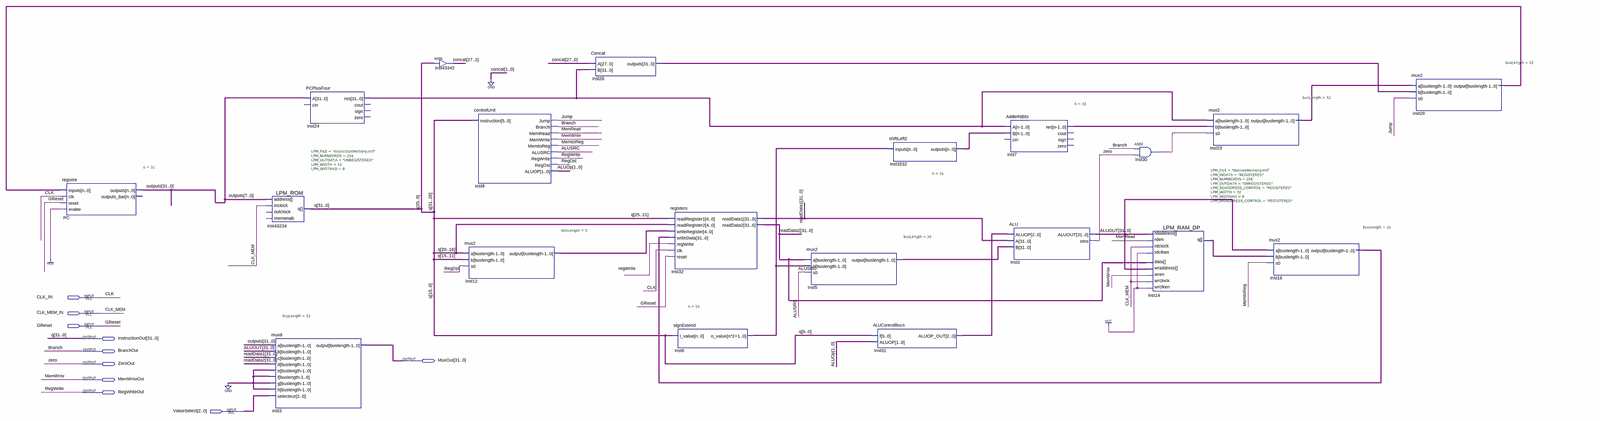
[diagram p0: schematic sheet, whole]
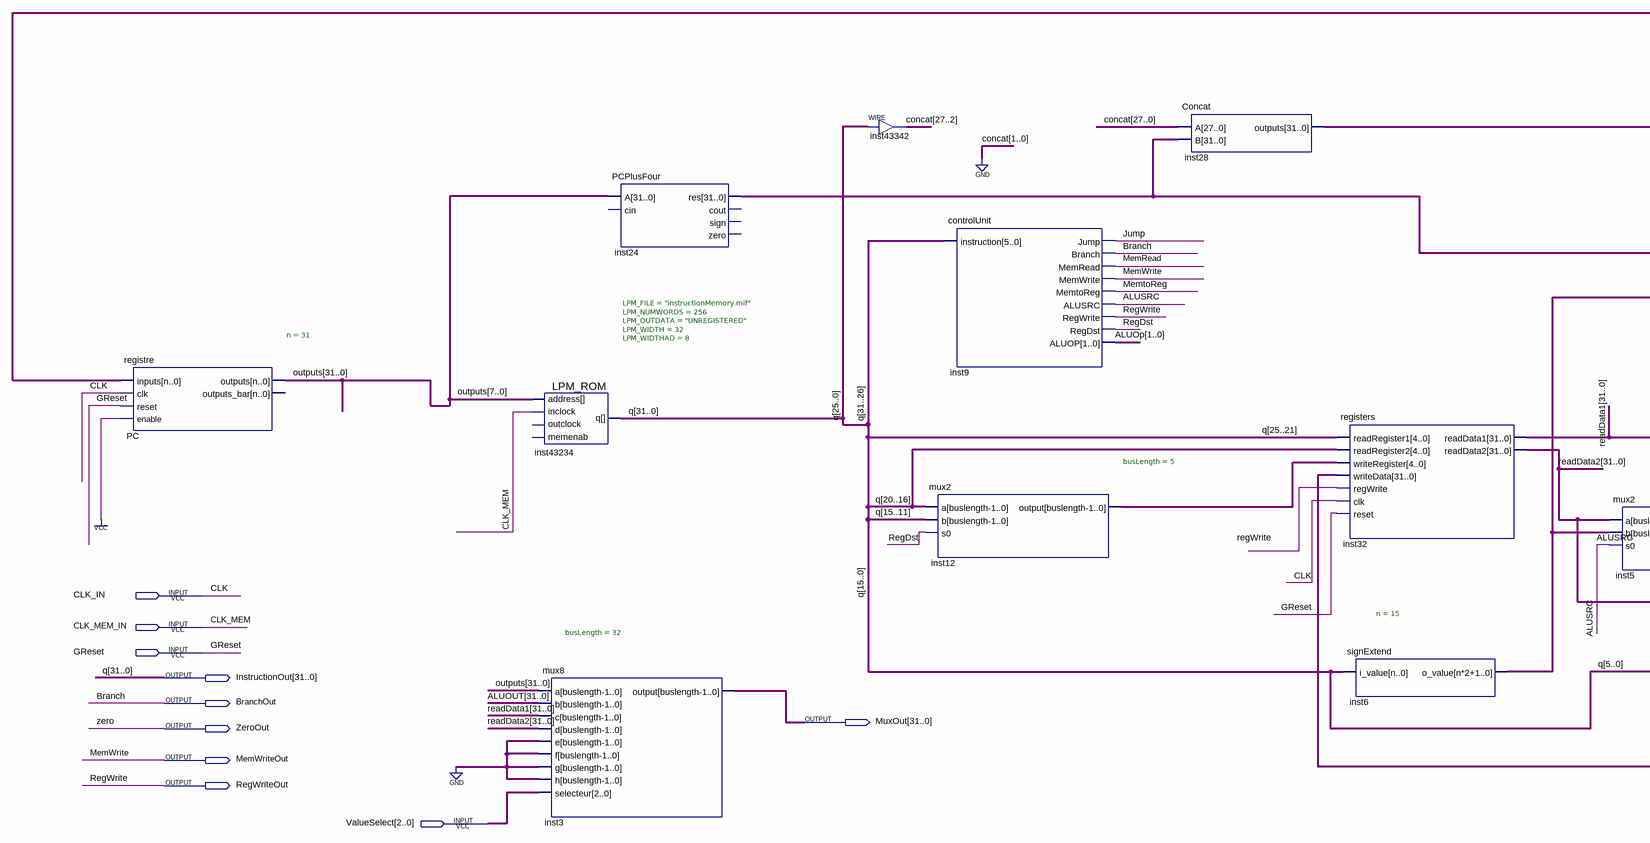
[diagram p1: schematic sheet, left part]
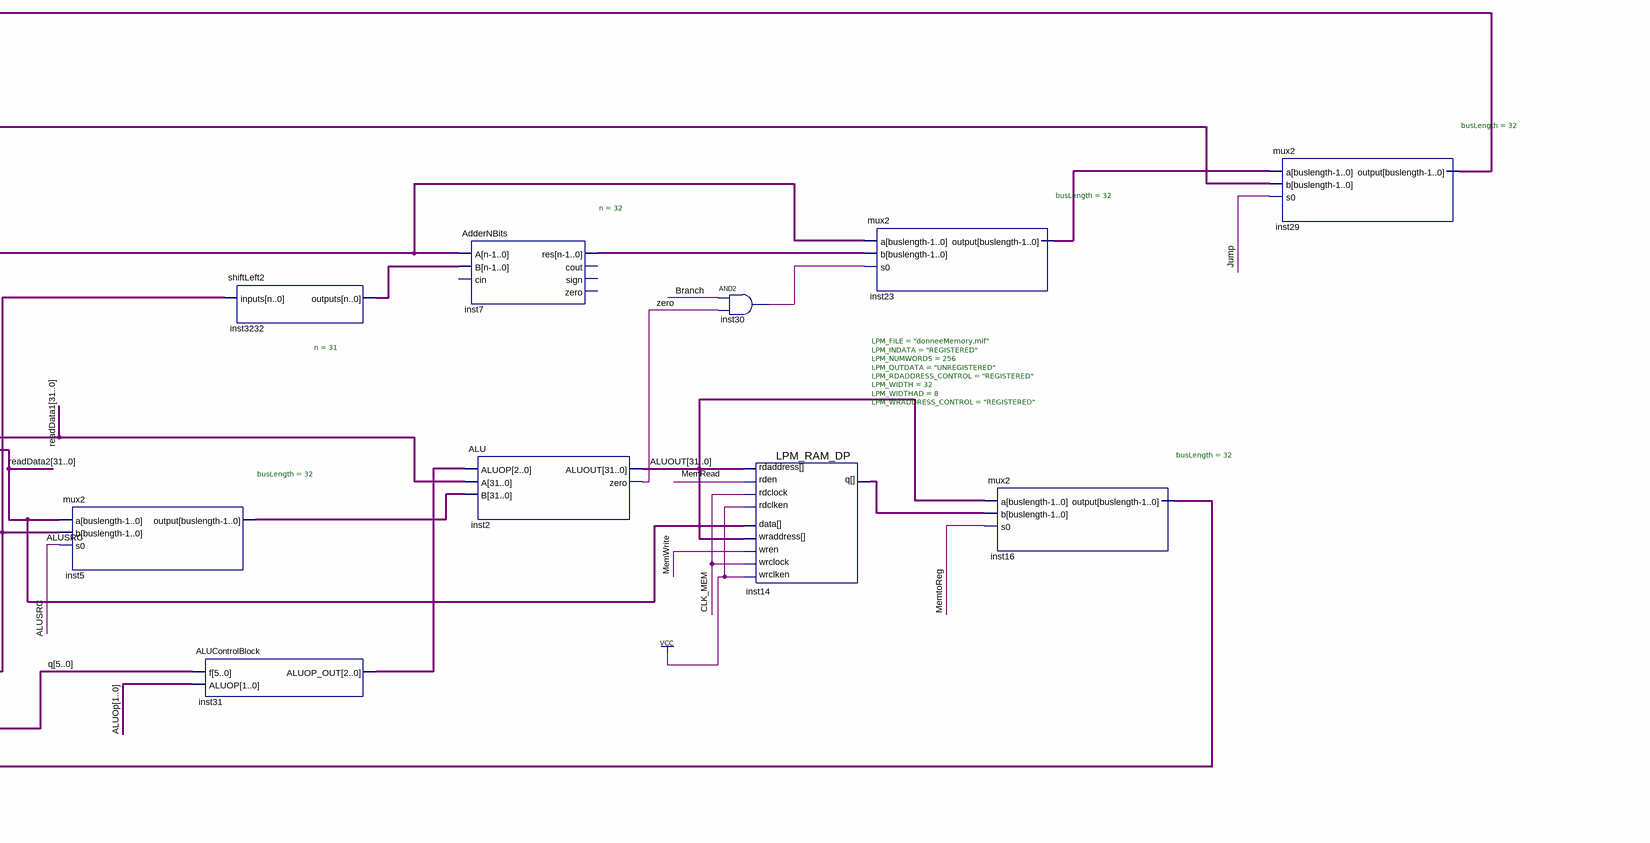
[diagram p2: schematic sheet, right part]
// Quartus schematic Lab2.bdf as structural Verilog: 20 symbols, 10 pins
module Lab2 (
  input  CLK_IN,
  input  CLK_MEM_IN,
  input  GReset,
  input  [2:0] ValueSelect,
  output [31:0] InstructionOut,
  output BranchOut,
  output [31:0] MuxOut,
  output ZeroOut,
  output MemWriteOut,
  output RegWriteOut
);

  wire ALUSRC, inst30_out, Jump, MemRead, MemtoReg, RegDst;
  wire [1:0] ALUOp;
  wire [2:0] inst31_aluop_out;
  wire [4:0] inst12_output;
  wire [27:2] concat;
  wire [31:0] ALUOUT, inst5_output, inst6_o_value, inst7_res, inst14_q, inst16_output, inst23_output,
       inst24_res, inst28_outputs, inst29_output, inst3232_outputs, outputs, readData1, readData2;

  registre #(.n(31)) PC (
    .inputs(inst29_output), .clk(CLK_IN), .reset(GReset), .enable(1'b1), .outputs(outputs));  // open: outputs_bar
  LPM_ROM #(.LPM_FILE("instructionMemory.mif"), .LPM_NUMWORDS(256), .LPM_OUTDATA("UNREGISTERED"), .LPM_WIDTH(32), .LPM_WIDTHAD(8)) inst43234 (
    .address(outputs[7:0]), .inclock(CLK_MEM_IN), .q(InstructionOut));  // open: outclock, memenab
  mux8 #(.busLength(32)) inst3 (
    .a(outputs), .b(ALUOUT), .c(readData1), .d(readData2), .e({32{1'b0}}), .f({32{1'b0}}), .g({32{1'b0}}),
    .h({32{1'b0}}), .selecteur(ValueSelect), .\output (MuxOut));
  PCPlusFour inst24 (.A(outputs), .res(inst24_res));  // open: cin, cout, sign, zero
  assign concat = InstructionOut[25:0];  // WIRE inst43342
  mux2 #(.busLength(5)) inst12 (
    .a(InstructionOut[20:16]), .b(InstructionOut[15:11]), .s0(RegDst), .\output (inst12_output));
  controlUnit inst9 (
    .instruction(InstructionOut[31:26]), .Jump(Jump), .Branch(BranchOut), .MemRead(MemRead),
    .MemWrite(MemWriteOut), .MemtoReg(MemtoReg), .ALUSRC(ALUSRC), .RegWrite(RegWriteOut), .RegDst(RegDst),
    .ALUOP(ALUOp));
  Concat inst28 (.A({concat, 2'b00}), .B(inst24_res), .outputs(inst28_outputs));
  registers inst32 (
    .readRegister1(InstructionOut[25:21]), .readRegister2(InstructionOut[20:16]),
    .writeRegister(inst12_output), .writeData(inst16_output), .regWrite(RegWriteOut), .clk(CLK_IN),
    .reset(GReset), .readData1(readData1), .readData2(readData2));
  signExtend #(.n(15)) inst6 (.i_value(InstructionOut[15:0]), .o_value(inst6_o_value));
  mux2 #(.busLength(32)) inst5 (.a(readData2), .b(inst6_o_value), .s0(ALUSRC), .\output (inst5_output));
  shiftLeft2 #(.n(31)) inst3232 (.inputs(inst6_o_value), .outputs(inst3232_outputs));
  ALUControlBlock inst31 (.f(InstructionOut[5:0]), .ALUOP(ALUOp), .ALUOP_OUT(inst31_aluop_out));
  AdderNBits #(.n(32)) inst7 (.A(inst24_res), .B(inst3232_outputs), .res(inst7_res));  // open: cin, cout, sign, zero
  ALU inst2 (.ALUOP(inst31_aluop_out), .A(readData1), .B(inst5_output), .ALUOUT(ALUOUT), .zero(ZeroOut));
  and inst30 (inst30_out, BranchOut, ZeroOut);
  LPM_RAM_DP #(.LPM_FILE("donneeMemory.mif"), .LPM_INDATA("REGISTERED"), .LPM_NUMWORDS(256), .LPM_OUTDATA("UNREGISTERED"), .LPM_RDADDRESS_CONTROL("REGISTERED"), .LPM_WIDTH(32), .LPM_WIDTHAD(8), .LPM_WRADDRESS_CONTROL("REGISTERED")) inst14 (
    .rden(MemRead), .rdclock(CLK_MEM_IN), .rdclken(1'b1), .wren(MemWriteOut), .wrclock(CLK_MEM_IN),
    .wrclken(1'b1), .rdaddress(ALUOUT[7:0]), .data(readData2), .wraddress(ALUOUT[7:0]), .q(inst14_q));
  mux2 #(.busLength(32)) inst23 (.a(inst24_res), .b(inst7_res), .s0(inst30_out), .\output (inst23_output));
  mux2 #(.busLength(32)) inst16 (.a(ALUOUT), .b(inst14_q), .s0(MemtoReg), .\output (inst16_output));
  mux2 #(.busLength(32)) inst29 (.a(inst23_output), .b(inst28_outputs), .s0(Jump), .\output (inst29_output));

  // Other names for the same wires on the sheet: Branch = BranchOut; CLK = CLK_IN; CLK_MEM = CLK_MEM_IN;
  //   MemWrite = MemWriteOut; q[31:0] = InstructionOut; RegWrite = RegWriteOut; zero = ZeroOut
endmodule
